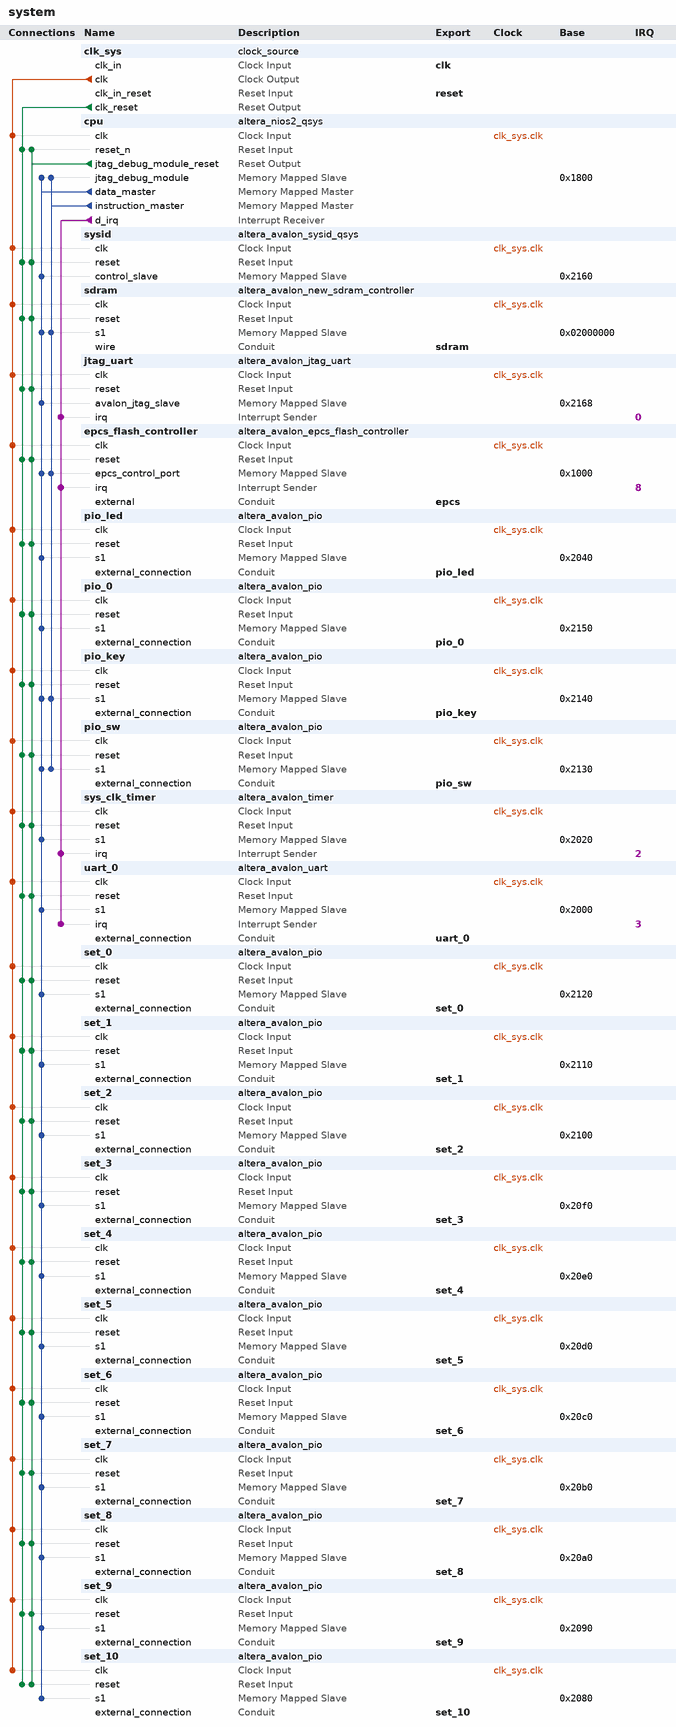
[diagram p0: system contents]
# Platform Designer (Qsys) system system, Cyclone IV E EP4CE22F17C6
# Parameters at their usual value, and those the tool derives, are not listed.
package require -exact qsys 13.0.1
create_system system
set_project_property DEVICE_FAMILY {Cyclone IV E}
set_project_property DEVICE EP4CE22F17C6

add_instance clk_sys clock_source 13.0
set_instance_parameter_value clk_sys clockFrequency 100000000
set_instance_parameter_value clk_sys resetSynchronousEdges DEASSERT

add_instance cpu altera_nios2_qsys 13.0
set_instance_parameter_value cpu resetSlave epcs_flash_controller.epcs_control_port
set_instance_parameter_value cpu mmu_TLBMissExcSlave None
set_instance_parameter_value cpu exceptionSlave sdram.s1
set_instance_parameter_value cpu breakSlave cpu.jtag_debug_module
set_instance_parameter_value cpu impl Tiny
set_instance_parameter_value cpu icache_size 8192
set_instance_parameter_value cpu dcache_size 4096

add_instance sysid altera_avalon_sysid_qsys 13.0
set_instance_parameter_value sysid id 0

add_instance sdram altera_avalon_new_sdram_controller 13.0.1
set_instance_parameter_value sdram TAC 5.5
set_instance_parameter_value sdram TRCD 20.0
set_instance_parameter_value sdram TRP 20.0
set_instance_parameter_value sdram casLatency 3
set_instance_parameter_value sdram columnWidth 9
set_instance_parameter_value sdram dataWidth 16
set_instance_parameter_value sdram generateSimulationModel false
set_instance_parameter_value sdram initRefreshCommands 8
set_instance_parameter_value sdram model single_Micron_MT48LC4M32B2_7_chip
set_instance_parameter_value sdram numberOfBanks 4
set_instance_parameter_value sdram numberOfChipSelects 1
set_instance_parameter_value sdram powerUpDelay 200.0
set_instance_parameter_value sdram refreshPeriod 7.8125
set_instance_parameter_value sdram rowWidth 13

add_instance jtag_uart altera_avalon_jtag_uart 13.0.1
set_instance_parameter_value jtag_uart simInteractiveOptions NO_INTERACTIVE_WINDOWS

add_instance epcs_flash_controller altera_avalon_epcs_flash_controller 13.0.1

add_instance pio_led altera_avalon_pio 13.0.1
set_instance_parameter_value pio_led bitModifyingOutReg true
set_instance_parameter_value pio_led direction Output
set_instance_parameter_value pio_led width 8

add_instance pio_0 altera_avalon_pio 13.0.1
set_instance_parameter_value pio_0 direction Output
set_instance_parameter_value pio_0 width 8

add_instance pio_key altera_avalon_pio 13.0.1
set_instance_parameter_value pio_key direction Input
set_instance_parameter_value pio_key width 2

add_instance pio_sw altera_avalon_pio 13.0.1
set_instance_parameter_value pio_sw direction Input
set_instance_parameter_value pio_sw width 4

add_instance sys_clk_timer altera_avalon_timer 13.0.1
set_instance_parameter_value sys_clk_timer period 1
set_instance_parameter_value sys_clk_timer periodUnits MSEC

add_instance uart_0 altera_avalon_uart 13.0.1
set_instance_parameter_value uart_0 baud 115200
set_instance_parameter_value uart_0 dataBits 8
set_instance_parameter_value uart_0 fixedBaud false
set_instance_parameter_value uart_0 parity NONE
set_instance_parameter_value uart_0 stopBits 1

add_instance set_0 altera_avalon_pio 13.0.1
set_instance_parameter_value set_0 direction InOut
set_instance_parameter_value set_0 width 16

add_instance set_1 altera_avalon_pio 13.0.1
set_instance_parameter_value set_1 direction InOut
set_instance_parameter_value set_1 width 16

add_instance set_2 altera_avalon_pio 13.0.1
set_instance_parameter_value set_2 direction InOut
set_instance_parameter_value set_2 width 16

add_instance set_3 altera_avalon_pio 13.0.1
set_instance_parameter_value set_3 direction InOut
set_instance_parameter_value set_3 width 16

add_instance set_4 altera_avalon_pio 13.0.1
set_instance_parameter_value set_4 direction InOut
set_instance_parameter_value set_4 width 16

add_instance set_5 altera_avalon_pio 13.0.1
set_instance_parameter_value set_5 direction InOut
set_instance_parameter_value set_5 width 16

add_instance set_6 altera_avalon_pio 13.0.1
set_instance_parameter_value set_6 direction InOut
set_instance_parameter_value set_6 width 16

add_instance set_7 altera_avalon_pio 13.0.1
set_instance_parameter_value set_7 direction InOut
set_instance_parameter_value set_7 width 16

add_instance set_8 altera_avalon_pio 13.0.1
set_instance_parameter_value set_8 direction InOut
set_instance_parameter_value set_8 width 16

add_instance set_9 altera_avalon_pio 13.0.1
set_instance_parameter_value set_9 direction InOut
set_instance_parameter_value set_9 width 16

add_instance set_10 altera_avalon_pio 13.0.1
set_instance_parameter_value set_10 direction InOut
set_instance_parameter_value set_10 width 16

# connections
add_connection clk_sys.clk cpu.clk clock
add_connection clk_sys.clk epcs_flash_controller.clk clock
add_connection clk_sys.clk jtag_uart.clk clock
add_connection clk_sys.clk pio_0.clk clock
add_connection clk_sys.clk pio_key.clk clock
add_connection clk_sys.clk pio_led.clk clock
add_connection clk_sys.clk pio_sw.clk clock
add_connection clk_sys.clk sdram.clk clock
add_connection clk_sys.clk set_0.clk clock
add_connection clk_sys.clk set_1.clk clock
add_connection clk_sys.clk set_2.clk clock
add_connection clk_sys.clk set_3.clk clock
add_connection clk_sys.clk set_4.clk clock
add_connection clk_sys.clk set_5.clk clock
add_connection clk_sys.clk set_6.clk clock
add_connection clk_sys.clk set_7.clk clock
add_connection clk_sys.clk set_8.clk clock
add_connection clk_sys.clk set_9.clk clock
add_connection clk_sys.clk set_10.clk clock
add_connection clk_sys.clk sys_clk_timer.clk clock
add_connection clk_sys.clk sysid.clk clock
add_connection clk_sys.clk uart_0.clk clock
add_connection clk_sys.clk_reset cpu.reset_n reset
add_connection clk_sys.clk_reset epcs_flash_controller.reset reset
add_connection clk_sys.clk_reset jtag_uart.reset reset
add_connection clk_sys.clk_reset pio_0.reset reset
add_connection clk_sys.clk_reset pio_key.reset reset
add_connection clk_sys.clk_reset pio_led.reset reset
add_connection clk_sys.clk_reset pio_sw.reset reset
add_connection clk_sys.clk_reset sdram.reset reset
add_connection clk_sys.clk_reset set_0.reset reset
add_connection clk_sys.clk_reset set_1.reset reset
add_connection clk_sys.clk_reset set_2.reset reset
add_connection clk_sys.clk_reset set_3.reset reset
add_connection clk_sys.clk_reset set_4.reset reset
add_connection clk_sys.clk_reset set_5.reset reset
add_connection clk_sys.clk_reset set_6.reset reset
add_connection clk_sys.clk_reset set_7.reset reset
add_connection clk_sys.clk_reset set_8.reset reset
add_connection clk_sys.clk_reset set_9.reset reset
add_connection clk_sys.clk_reset set_10.reset reset
add_connection clk_sys.clk_reset sys_clk_timer.reset reset
add_connection clk_sys.clk_reset sysid.reset reset
add_connection clk_sys.clk_reset uart_0.reset reset
add_connection cpu.jtag_debug_module_reset cpu.reset_n reset
add_connection cpu.jtag_debug_module_reset epcs_flash_controller.reset reset
add_connection cpu.jtag_debug_module_reset jtag_uart.reset reset
add_connection cpu.jtag_debug_module_reset pio_0.reset reset
add_connection cpu.jtag_debug_module_reset pio_key.reset reset
add_connection cpu.jtag_debug_module_reset pio_led.reset reset
add_connection cpu.jtag_debug_module_reset pio_sw.reset reset
add_connection cpu.jtag_debug_module_reset sdram.reset reset
add_connection cpu.jtag_debug_module_reset set_0.reset reset
add_connection cpu.jtag_debug_module_reset set_1.reset reset
add_connection cpu.jtag_debug_module_reset set_2.reset reset
add_connection cpu.jtag_debug_module_reset set_3.reset reset
add_connection cpu.jtag_debug_module_reset set_4.reset reset
add_connection cpu.jtag_debug_module_reset set_5.reset reset
add_connection cpu.jtag_debug_module_reset set_6.reset reset
add_connection cpu.jtag_debug_module_reset set_7.reset reset
add_connection cpu.jtag_debug_module_reset set_8.reset reset
add_connection cpu.jtag_debug_module_reset set_9.reset reset
add_connection cpu.jtag_debug_module_reset set_10.reset reset
add_connection cpu.jtag_debug_module_reset sys_clk_timer.reset reset
add_connection cpu.jtag_debug_module_reset sysid.reset reset
add_connection cpu.jtag_debug_module_reset uart_0.reset reset
add_connection cpu.data_master cpu.jtag_debug_module avalon
set_connection_parameter_value cpu.data_master/cpu.jtag_debug_module baseAddress 0x1800
add_connection cpu.data_master epcs_flash_controller.epcs_control_port avalon
set_connection_parameter_value cpu.data_master/epcs_flash_controller.epcs_control_port baseAddress 0x1000
add_connection cpu.data_master jtag_uart.avalon_jtag_slave avalon
set_connection_parameter_value cpu.data_master/jtag_uart.avalon_jtag_slave baseAddress 0x2168
add_connection cpu.data_master pio_0.s1 avalon
set_connection_parameter_value cpu.data_master/pio_0.s1 baseAddress 0x2150
add_connection cpu.data_master pio_key.s1 avalon
set_connection_parameter_value cpu.data_master/pio_key.s1 baseAddress 0x2140
add_connection cpu.data_master pio_led.s1 avalon
set_connection_parameter_value cpu.data_master/pio_led.s1 baseAddress 0x2040
add_connection cpu.data_master pio_sw.s1 avalon
set_connection_parameter_value cpu.data_master/pio_sw.s1 baseAddress 0x2130
add_connection cpu.data_master sdram.s1 avalon
set_connection_parameter_value cpu.data_master/sdram.s1 baseAddress 0x02000000
add_connection cpu.data_master set_0.s1 avalon
set_connection_parameter_value cpu.data_master/set_0.s1 baseAddress 0x2120
add_connection cpu.data_master set_1.s1 avalon
set_connection_parameter_value cpu.data_master/set_1.s1 baseAddress 0x2110
add_connection cpu.data_master set_2.s1 avalon
set_connection_parameter_value cpu.data_master/set_2.s1 baseAddress 0x2100
add_connection cpu.data_master set_3.s1 avalon
set_connection_parameter_value cpu.data_master/set_3.s1 baseAddress 0x20f0
add_connection cpu.data_master set_4.s1 avalon
set_connection_parameter_value cpu.data_master/set_4.s1 baseAddress 0x20e0
add_connection cpu.data_master set_5.s1 avalon
set_connection_parameter_value cpu.data_master/set_5.s1 baseAddress 0x20d0
add_connection cpu.data_master set_6.s1 avalon
set_connection_parameter_value cpu.data_master/set_6.s1 baseAddress 0x20c0
add_connection cpu.data_master set_7.s1 avalon
set_connection_parameter_value cpu.data_master/set_7.s1 baseAddress 0x20b0
add_connection cpu.data_master set_8.s1 avalon
set_connection_parameter_value cpu.data_master/set_8.s1 baseAddress 0x20a0
add_connection cpu.data_master set_9.s1 avalon
set_connection_parameter_value cpu.data_master/set_9.s1 baseAddress 0x2090
add_connection cpu.data_master set_10.s1 avalon
set_connection_parameter_value cpu.data_master/set_10.s1 baseAddress 0x2080
add_connection cpu.data_master sys_clk_timer.s1 avalon
set_connection_parameter_value cpu.data_master/sys_clk_timer.s1 baseAddress 0x2020
add_connection cpu.data_master sysid.control_slave avalon
set_connection_parameter_value cpu.data_master/sysid.control_slave baseAddress 0x2160
add_connection cpu.data_master uart_0.s1 avalon
set_connection_parameter_value cpu.data_master/uart_0.s1 baseAddress 0x2000
add_connection cpu.instruction_master cpu.jtag_debug_module avalon
set_connection_parameter_value cpu.instruction_master/cpu.jtag_debug_module baseAddress 0x1800
add_connection cpu.instruction_master epcs_flash_controller.epcs_control_port avalon
set_connection_parameter_value cpu.instruction_master/epcs_flash_controller.epcs_control_port baseAddress 0x1000
add_connection cpu.instruction_master pio_key.s1 avalon
set_connection_parameter_value cpu.instruction_master/pio_key.s1 baseAddress 0x2140
add_connection cpu.instruction_master pio_sw.s1 avalon
set_connection_parameter_value cpu.instruction_master/pio_sw.s1 baseAddress 0x2130
add_connection cpu.instruction_master sdram.s1 avalon
set_connection_parameter_value cpu.instruction_master/sdram.s1 baseAddress 0x02000000
add_connection cpu.d_irq epcs_flash_controller.irq interrupt
set_connection_parameter_value cpu.d_irq/epcs_flash_controller.irq irqNumber 8
add_connection cpu.d_irq jtag_uart.irq interrupt
set_connection_parameter_value cpu.d_irq/jtag_uart.irq irqNumber 0
add_connection cpu.d_irq sys_clk_timer.irq interrupt
set_connection_parameter_value cpu.d_irq/sys_clk_timer.irq irqNumber 2
add_connection cpu.d_irq uart_0.irq interrupt
set_connection_parameter_value cpu.d_irq/uart_0.irq irqNumber 3

# exported interfaces
add_interface clk clock sink
set_interface_property clk EXPORT_OF clk_sys.clk_in
add_interface pio_led conduit end
set_interface_property pio_led EXPORT_OF pio_led.external_connection
add_interface epcs conduit end
set_interface_property epcs EXPORT_OF epcs_flash_controller.external
add_interface sdram conduit end
set_interface_property sdram EXPORT_OF sdram.wire
add_interface uart_0 conduit end
set_interface_property uart_0 EXPORT_OF uart_0.external_connection
add_interface reset reset sink
set_interface_property reset EXPORT_OF clk_sys.clk_in_reset
add_interface pio_0 conduit end
set_interface_property pio_0 EXPORT_OF pio_0.external_connection
add_interface pio_key conduit end
set_interface_property pio_key EXPORT_OF pio_key.external_connection
add_interface pio_sw conduit end
set_interface_property pio_sw EXPORT_OF pio_sw.external_connection
add_interface set_0 conduit end
set_interface_property set_0 EXPORT_OF set_0.external_connection
add_interface set_1 conduit end
set_interface_property set_1 EXPORT_OF set_1.external_connection
add_interface set_2 conduit end
set_interface_property set_2 EXPORT_OF set_2.external_connection
add_interface set_3 conduit end
set_interface_property set_3 EXPORT_OF set_3.external_connection
add_interface set_4 conduit end
set_interface_property set_4 EXPORT_OF set_4.external_connection
add_interface set_5 conduit end
set_interface_property set_5 EXPORT_OF set_5.external_connection
add_interface set_6 conduit end
set_interface_property set_6 EXPORT_OF set_6.external_connection
add_interface set_7 conduit end
set_interface_property set_7 EXPORT_OF set_7.external_connection
add_interface set_8 conduit end
set_interface_property set_8 EXPORT_OF set_8.external_connection
add_interface set_9 conduit end
set_interface_property set_9 EXPORT_OF set_9.external_connection
add_interface set_10 conduit end
set_interface_property set_10 EXPORT_OF set_10.external_connection

set_interconnect_requirement {$system} qsys_mm.clockCrossingAdapter HANDSHAKE
set_interconnect_requirement {$system} qsys_mm.maxAdditionalLatency 1

save_system system.qsys
